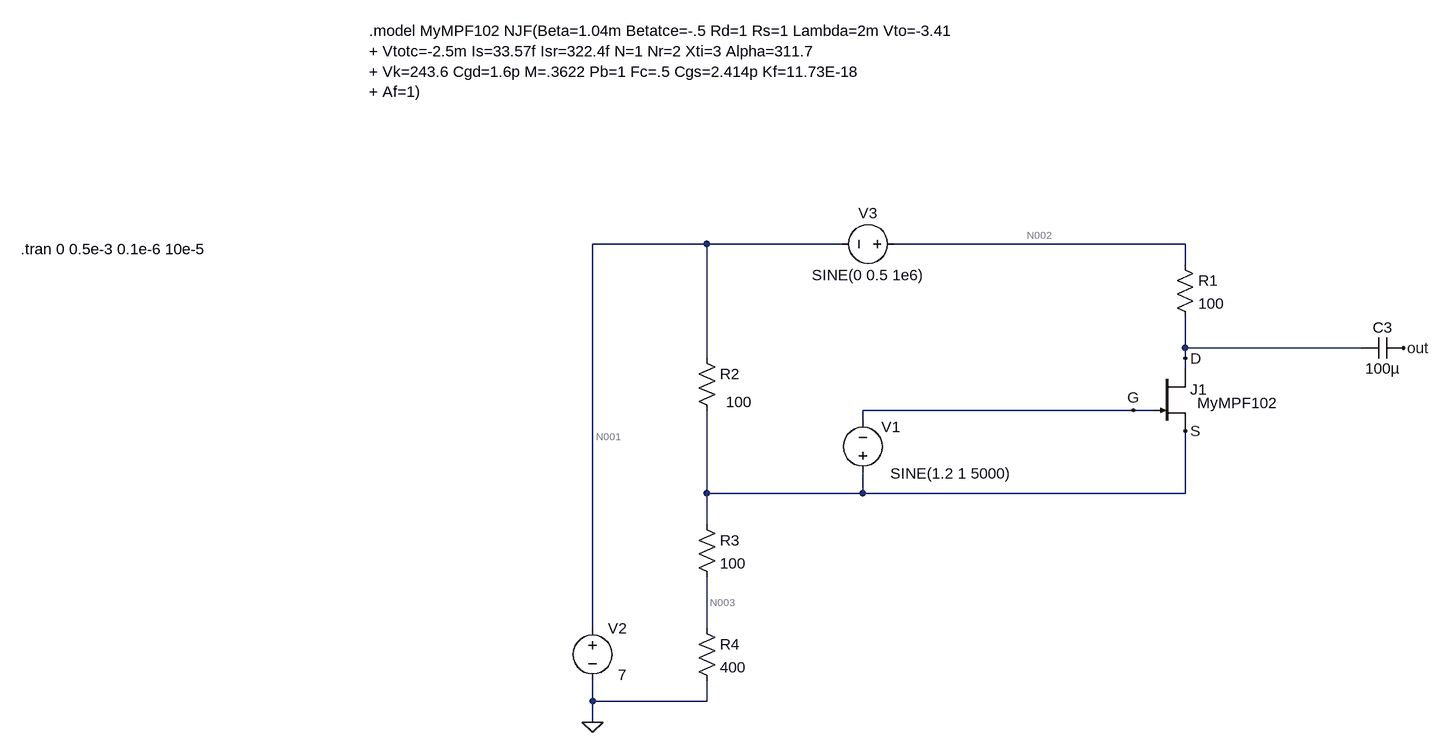
[diagram p0: schematic Fifth_JFET_AM.asc]
Fifth_JFET_AM.asc, the LTspice schematic file:
Version 4
SHEET 1 1424 692
WIRE -496 -64 -672 -64
WIRE -288 -64 -496 -64
WIRE 240 -64 -208 -64
WIRE 240 -32 240 -64
WIRE 240 96 240 48
WIRE 512 96 240 96
WIRE -496 112 -496 -64
WIRE 240 112 240 96
WIRE 240 128 240 112
WIRE 160 192 -256 192
WIRE 192 192 160 192
WIRE -256 208 -256 192
WIRE -496 320 -496 192
WIRE -256 320 -256 288
WIRE -256 320 -496 320
WIRE 240 320 240 224
WIRE 240 320 -256 320
WIRE -496 368 -496 320
WIRE -672 528 -672 -64
WIRE -496 528 -496 448
WIRE -672 640 -672 608
WIRE -496 640 -496 608
WIRE -496 640 -672 640
WIRE -672 672 -672 640
FLAG 160 192 G
FLAG 240 112 D
FLAG 240 224 S
FLAG 576 96 out
FLAG -672 672 0
SYMBOL njf 192 128 R0
WINDOW 3 67 53 Left 2
SYMATTR Value MyMPF102
SYMATTR InstName J1
SYMBOL voltage -256 304 R180
WINDOW 123 24 124 Left 2
WINDOW 39 0 0 Left 0
WINDOW 0 -58 86 Left 2
WINDOW 3 -229 15 Left 2
SYMATTR InstName V1
SYMATTR Value SINE(1.2 1 5000)
SYMBOL cap 576 80 R90
WINDOW 0 0 32 VBottom 2
WINDOW 3 32 32 VTop 2
SYMATTR InstName C3
SYMATTR Value 100µ
SYMBOL voltage -192 -64 R90
WINDOW 0 -32 56 VBottom 2
WINDOW 3 32 56 VTop 2
WINDOW 123 0 0 Left 0
WINDOW 39 0 0 Left 0
SYMATTR InstName V3
SYMATTR Value SINE(0 0.5 1e6)
SYMBOL voltage -672 512 R0
WINDOW 3 39 87 Left 2
WINDOW 123 0 0 Left 0
WINDOW 39 0 0 Left 0
SYMATTR InstName V2
SYMATTR Value 7
SYMBOL res 224 -48 R0
SYMATTR InstName R1
SYMATTR Value 100
SYMBOL res -512 96 R0
WINDOW 3 45 83 Left 2
SYMATTR InstName R2
SYMATTR Value 100
SYMBOL res -512 352 R0
SYMATTR InstName R3
SYMATTR Value 100
SYMBOL res -512 512 R0
SYMATTR InstName R4
SYMATTR Value 400
TEXT -1016 -392 Left 2 !.model MyMPF102 NJF(Beta=1.04m Betatce=-.5 Rd=1 Rs=1 Lambda=2m Vto=-3.41\n+ Vtotc=-2.5m Is=33.57f Isr=322.4f N=1 Nr=2 Xti=3 Alpha=311.7\n+ Vk=243.6 Cgd=1.6p M=.3622 Pb=1 Fc=.5 Cgs=2.414p Kf=11.73E-18\n+ Af=1)
TEXT -1552 -56 Left 2 !.tran 0 0.5e-3 0.1e-6 10e-5

The netlist it stands for:
* Fifth_JFET_AM.asc
J1 D G S MyMPF102
V1 S G SINE(1.2 1 5000)
C3 out D 100µ
V3 N002 N001 SINE(0 0.5 1e6)
V2 N001 0 7
R1 N002 D 100
R2 N001 S 100
R3 S N003 100
R4 N003 0 400
.model NJF NJF
.model PJF PJF
.lib standard.jft
.model MyMPF102 NJF(Beta=1.04m Betatce=-.5 Rd=1 Rs=1 Lambda=2m Vto=-3.41
+ Vtotc=-2.5m Is=33.57f Isr=322.4f N=1 Nr=2 Xti=3 Alpha=311.7
+ Vk=243.6 Cgd=1.6p M=.3622 Pb=1 Fc=.5 Cgs=2.414p Kf=11.73E-18
+ Af=1)
.tran 0 0.5e-3 0.1e-6 10e-5
.backanno
.end

* Results of the author's LTspice run, read from the files saved beside the schematic
* Operating Point, zero values left out:
*   V(d) = 6.736 V
*   V(g) = 4.853 V
*   V(s) = 6.053 V
*   V(out) = 673.6 µV
*   V(n002) = 7 V
*   V(n001) = 7 V
*   V(n003) = 4.843 V
*   Id(J1) = 2.638 mA
*   Ig(J1) = -4.052 pA
*   Is(J1) = -2.638 mA
*   I(R4) = 12.11 mA
*   I(R3) = 12.11 mA
*   I(R2) = 9.469 mA
*   I(R1) = 2.638 mA
*   I(V2) = -12.11 mA
*   I(V3) = -2.638 mA
*   I(V1) = -4.052 pA
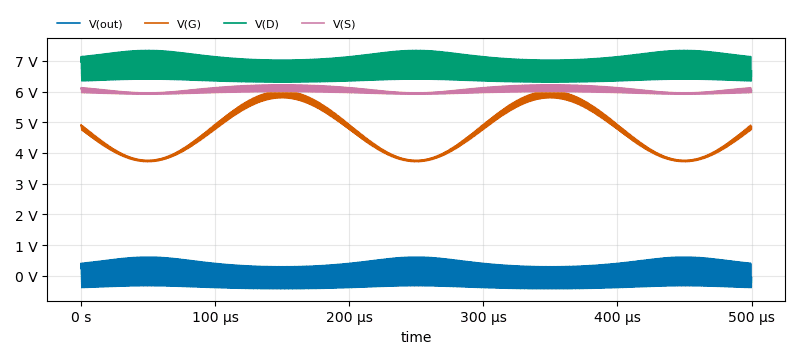
[diagram p1: Transient Analysis of Fifth_JFET_AM.asc, plotted from the saved traces]
* Transient Analysis, 1 run:
*   V(out): min -429 mV, max 610.5 mV, average 30.21 mV, rms 304.3 mV, last 542.7 µV
*   V(G): min 3.715 V, max 6.023 V, average 4.701 V, rms 4.762 V, last 4.853 V
*   V(D): min 6.307 V, max 7.346 V, average 6.766 V, rms 6.773 V, last 6.736 V
*   V(S): min 5.915 V, max 6.223 V, average 6.029 V, rms 6.029 V, last 6.053 V